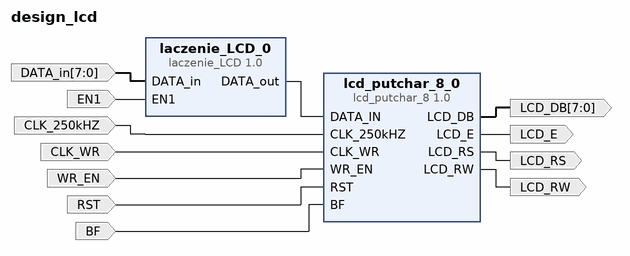
[diagram p0: block diagram of the top level]
# Vivado block design design_lcd, xc7z020clg400-2, Vivado 2019.1
create_bd_design design_lcd

create_bd_port -dir I -from 7 -to 0 DATA_in
create_bd_port -dir I EN1
create_bd_port -dir O LCD_E
create_bd_port -dir O LCD_RS
create_bd_port -dir O LCD_RW
create_bd_port -dir O -from 7 -to 0 LCD_DB
create_bd_port -dir I CLK_250kHZ
create_bd_port -dir I CLK_WR
create_bd_port -dir I WR_EN
create_bd_port -dir I -type rst RST
create_bd_port -dir I BF

create_bd_cell -type ip -vlnv xilinx.com:user:lcd_putchar_8:1.0 lcd_putchar_8_0
create_bd_cell -type ip -vlnv xilinx.com:user:laczenie_LCD:1.0 laczenie_LCD_0

# ---- connections ----

connect_bd_net [get_bd_pins laczenie_LCD_0/DATA_out] [get_bd_pins lcd_putchar_8_0/DATA_IN]
connect_bd_net -net DATA_in_0_1 [get_bd_ports DATA_in] [get_bd_pins laczenie_LCD_0/DATA_in]
connect_bd_net -net EN1_0_1 [get_bd_ports EN1] [get_bd_pins laczenie_LCD_0/EN1]
connect_bd_net [get_bd_pins lcd_putchar_8_0/LCD_E] [get_bd_ports LCD_E]
connect_bd_net [get_bd_pins lcd_putchar_8_0/LCD_RS] [get_bd_ports LCD_RS]
connect_bd_net [get_bd_pins lcd_putchar_8_0/LCD_RW] [get_bd_ports LCD_RW]
connect_bd_net [get_bd_pins lcd_putchar_8_0/LCD_DB] [get_bd_ports LCD_DB]
connect_bd_net -net CLK_250kHZ_0_1 [get_bd_ports CLK_250kHZ] [get_bd_pins lcd_putchar_8_0/CLK_250kHZ]
connect_bd_net -net CLK_WR_0_1 [get_bd_ports CLK_WR] [get_bd_pins lcd_putchar_8_0/CLK_WR]
connect_bd_net -net WR_EN_0_1 [get_bd_ports WR_EN] [get_bd_pins lcd_putchar_8_0/WR_EN]
connect_bd_net -net RST_0_1 [get_bd_ports RST] [get_bd_pins lcd_putchar_8_0/RST]
connect_bd_net -net BF_0_1 [get_bd_ports BF] [get_bd_pins lcd_putchar_8_0/BF]

validate_bd_design
save_bd_design
